# Altium schematic sheet assistPower.SchDoc
size A4
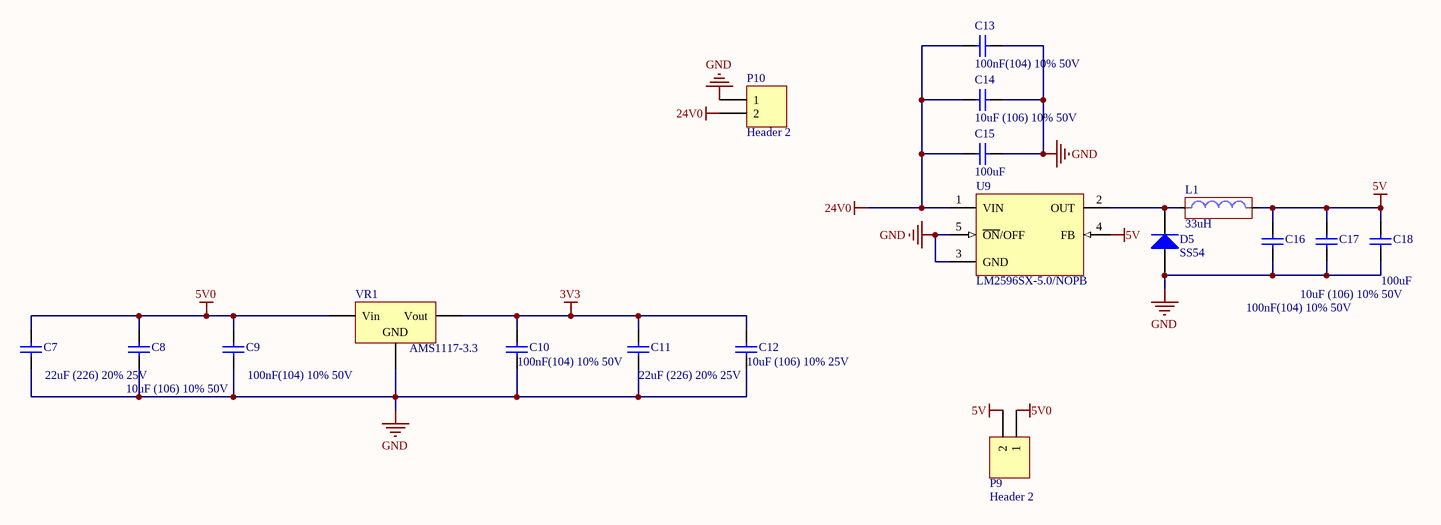
[diagram p0: assistPower.SchDoc]

## Parts
C7  22uF (226) 20% 25V  [0805_C]
C8  10uF (106) 10% 50V  [1206_C]
C9  100nF(104) 10% 50V  [0805_C]
C10  100nF(104) 10% 50V  [0805_C]
C11  22uF (226) 20% 25V  [0805_C]
C12  10uF (106) 10% 25V  [0805_C]
C13  100nF(104) 10% 50V  [0805_C]
C14  10uF (106) 10% 50V  [1206_C]
C15  value 100uF  [C100uF]  (hidden comment: Cap)
C16  100nF(104) 10% 50V  [0805_C]
C17  10uF (106) 10% 50V  [1206_C]
C18  value 100uF  [C100uF]  (hidden comment: Cap)
D5  SS54  [SMA(DO-214AC)_S1]
L1  33uH  [L-SMD-7]
P9  Header 2  [HDR1X2]
P10  Header 2  [5.08-2P]
U9  LM2596SX-5.0/NOPB  [TO-263-5]
VR1  AMS1117-3.3  [SOT-223]

## Nets
3V3: C10.2 C11.2 C12.2 VR1.2(Vout)
5V: C16.2 C17.2 C18.1 L1.1 P9.2 U9.4(FB)
5V0: C7.2 C8.2 C9.2 P9.1 VR1.3(Vin)
24V0: C13.1 C14.1 C15.2 P10.2 U9.1(VIN)
GND: C7.1 C8.1 C9.1 C10.1 C11.1 C12.1 C13.2 C14.2 C15.1 C16.1 C17.1 C18.2 D5.1(A) P10.1 U9.3(GND) U9.5(~{ON}/OFF) VR1.1(GND)
NetD5_2: D5.2(K) L1.2 U9.2(OUT)

## Library data of the parts
C7 C11 = 0805 22uF (226) 20% 25V: 贴片电容; ComponentLink1Description: 供应商链接; ComponentLink1URL: http://www.szlcsc.com/product/details_46786.html; Package: 0805; Supplier: LC; SuppliersPartNumber: C45783
C8 C14 C17 = 1206 10uF (106) 10% 50V: 贴片电容; ComponentLink1Description: 供应商链接; ComponentLink1URL: http://www.szlcsc.com/product/details_14236.html; Package: 1206; Supplier: LC; SuppliersPartNumber: C13585
C9 C10 C13 C16 = 0805 100nF(104) 10% 50V: 贴片电容; ComponentLink1Description: 供应商链接; ComponentLink1URL: http://www.szlcsc.com/product/details_50686.html; Package: 0805; Supplier: LC; SuppliersPartNumber: C49678
C12 = 0805 10uF (106) 10% 25V: 贴片电容; ComponentLink1Description: 供应商链接; ComponentLink1URL: http://www.szlcsc.com/product/details_16532.html; Package: 0805; Supplier: LC; SuppliersPartNumber: C15850
C15 C18 = Cap: 贴片电容; Published: 8-Jun-2000; LatestRevisionDate: 17-Jul-2002; LatestRevisionNote: Re-released for DXP Platform.; PackageReference: RAD-0.3; Publisher: Altium Limited
D5 = SMA(DO-214AC) SS54: 二极管; ComponentLink1Description: 供应商链接; ComponentLink1URL: http://www.szlcsc.com/product/details_23178.html; Package: SMA(DO-214AC); Supplier: LC; SuppliersPartNumber: C22452
L1 = Inductor
P9 P10 = Header 2: Header, 2-Pin; LatestRevisionDate: 17-Jul-2002; LatestRevisionNote: Re-released for DXP Platform.; Publisher: Altium Limited
U9 = LM2596SX-5.0/NOPB_[C10002]: DC-DC芯片; ComponentLink1Description: 供应商链接; ComponentLink1URL: http://www.szlcsc.com/product/details_10538.html; Package: TO-263-5; Supplier: LC; SuppliersPartNumber: C10002
VR1 = SOT-223 AMS1117-3.3: 低压差线性稳压(LDO); ComponentLink1Description: 供应商链接; ComponentLink1URL: http://www.szlcsc.com/product/details_6652.html; Package: SOT-223; Supplier: LC; SuppliersPartNumber: C6186